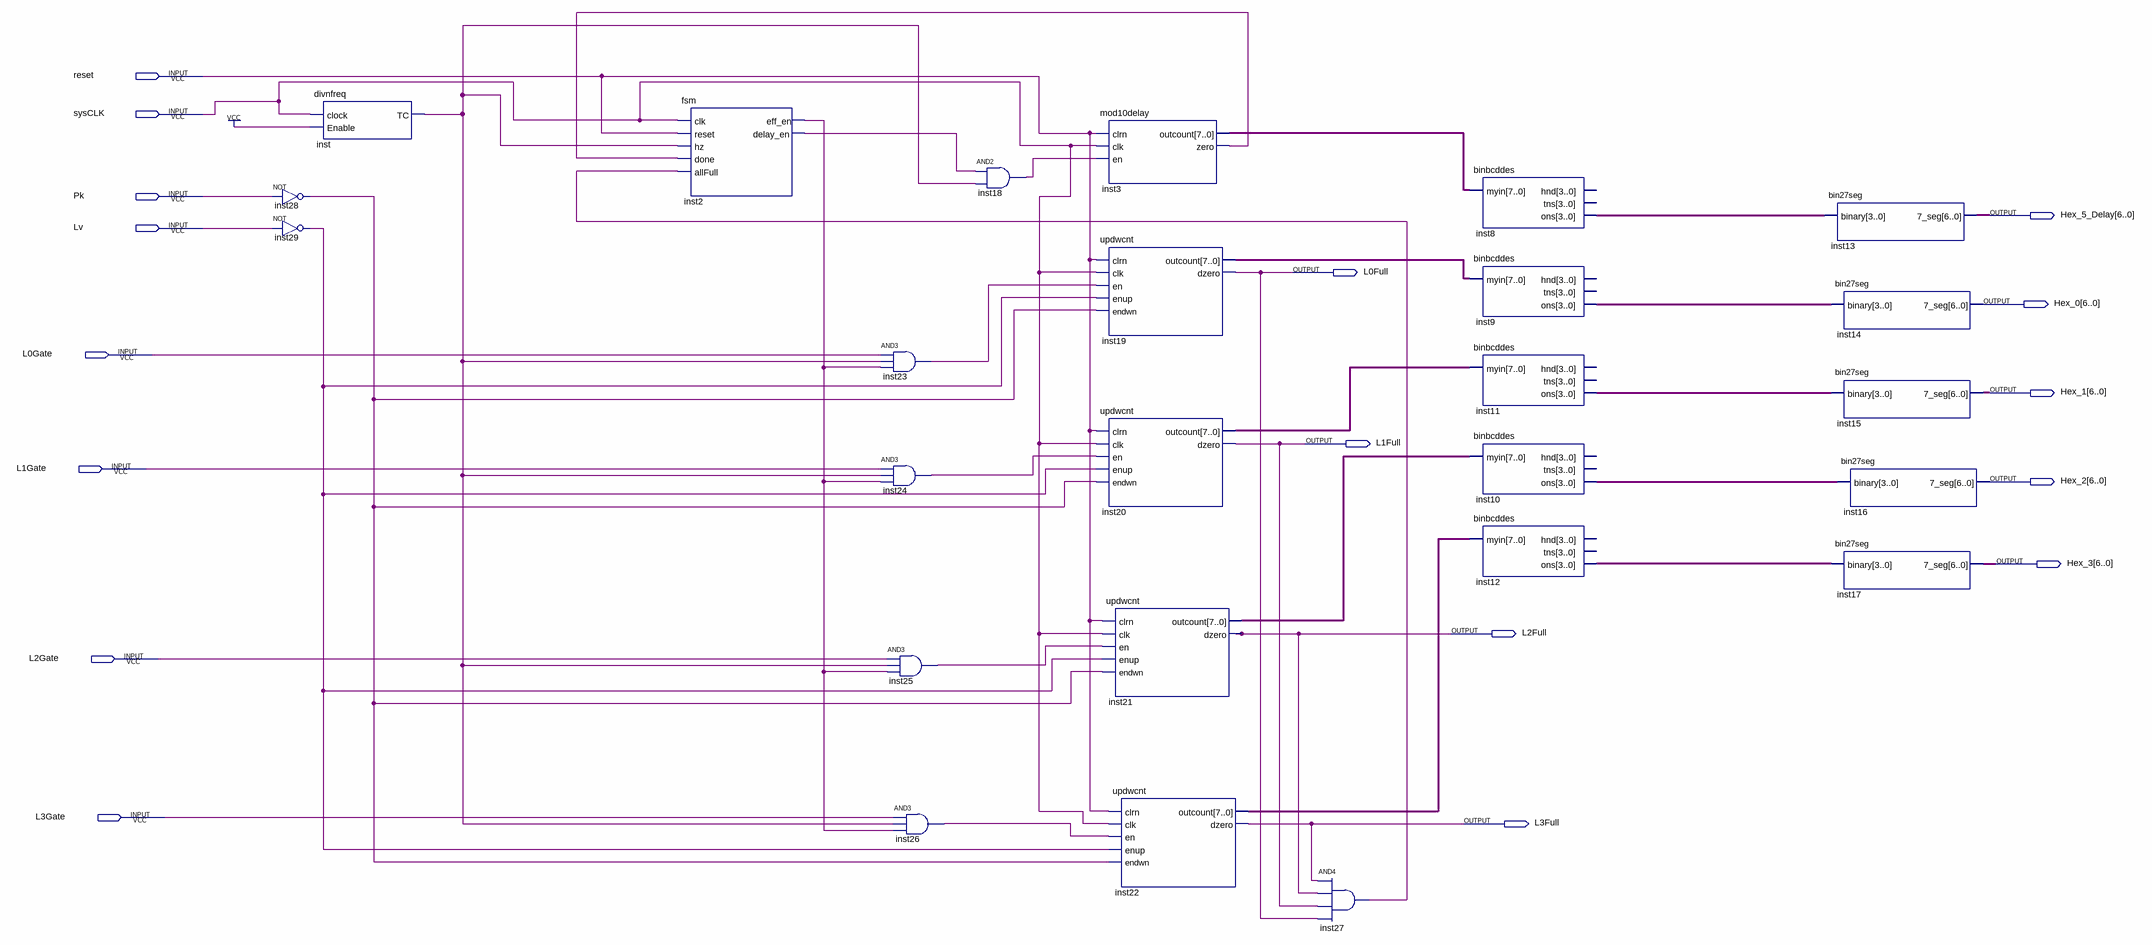
[diagram p0: schematic sheet]
// Quartus schematic JacobFox1_KylerMcCandless2_RyanBowman3.bdf as structural Verilog: 25 symbols, 17 pins
module JacobFox1_KylerMcCandless2_RyanBowman3 (
  input  reset,
  input  sysCLK,
  input  Pk,
  input  Lv,
  input  L0Gate,
  input  L1Gate,
  input  L2Gate,
  input  L3Gate,
  output [6:0] Hex_5_Delay,
  output L0Full,
  output [6:0] Hex_0,
  output [6:0] Hex_1,
  output L1Full,
  output [6:0] Hex_2,
  output [6:0] Hex_3,
  output L2Full,
  output L3Full
);

  wire inst2_delay_en, inst2_eff_en, inst3_zero, inst18_out, inst23_out, inst24_out, inst25_out, inst26_out,
       inst27_out, inst28_out, inst29_out, inst_tc;
  wire [3:0] inst8_ons, inst9_ons, inst10_ons, inst11_ons, inst12_ons;
  wire [7:0] inst3_outcount, inst19_outcount, inst20_outcount, inst21_outcount, inst22_outcount;

  not inst28 (inst28_out, Pk);
  not inst29 (inst29_out, Lv);
  divnfreq inst (.clock(sysCLK), .Enable(1'b1), .TC(inst_tc));
  fsm inst2 (
    .clk(sysCLK), .reset(reset), .hz(inst_tc), .done(inst3_zero), .allFull(inst27_out),
    .eff_en(inst2_eff_en), .delay_en(inst2_delay_en));
  and inst23 (inst23_out, L0Gate, inst_tc, inst2_eff_en);
  and inst24 (inst24_out, L1Gate, inst_tc, inst2_eff_en);
  and inst25 (inst25_out, L2Gate, inst_tc, inst2_eff_en);
  and inst26 (inst26_out, L3Gate, inst_tc, inst2_eff_en);
  and inst18 (inst18_out, inst2_delay_en, inst_tc);
  mod10delay inst3 (.clrn(reset), .clk(sysCLK), .en(inst18_out), .outcount(inst3_outcount), .zero(inst3_zero));
  updwcnt inst19 (
    .clrn(reset), .clk(sysCLK), .en(inst23_out), .enup(inst29_out), .endwn(inst28_out),
    .outcount(inst19_outcount), .dzero(L0Full));
  updwcnt inst20 (
    .clrn(reset), .clk(sysCLK), .en(inst24_out), .enup(inst29_out), .endwn(inst28_out),
    .outcount(inst20_outcount), .dzero(L1Full));
  updwcnt inst21 (
    .clrn(reset), .clk(sysCLK), .en(inst25_out), .enup(inst29_out), .endwn(inst28_out),
    .outcount(inst21_outcount), .dzero(L2Full));
  updwcnt inst22 (
    .clrn(reset), .clk(sysCLK), .en(inst26_out), .enup(inst29_out), .endwn(inst28_out),
    .outcount(inst22_outcount), .dzero(L3Full));
  and inst27 (inst27_out, L3Full, L2Full, L1Full, L0Full);
  binbcddes inst8 (.myin(inst3_outcount), .ons(inst8_ons));  // open: hnd, tns
  binbcddes inst9 (.myin(inst19_outcount), .ons(inst9_ons));  // open: hnd, tns
  binbcddes inst11 (.myin(inst20_outcount), .ons(inst11_ons));  // open: hnd, tns
  binbcddes inst10 (.myin(inst21_outcount), .ons(inst10_ons));  // open: hnd, tns
  binbcddes inst12 (.myin(inst22_outcount), .ons(inst12_ons));  // open: hnd, tns
  bin27seg inst13 (.binary(inst8_ons), .\7_seg (Hex_5_Delay));
  bin27seg inst14 (.binary(inst9_ons), .\7_seg (Hex_0));
  bin27seg inst15 (.binary(inst11_ons), .\7_seg (Hex_1));
  bin27seg inst16 (.binary(inst10_ons), .\7_seg (Hex_2));
  bin27seg inst17 (.binary(inst12_ons), .\7_seg (Hex_3));
endmodule
